# EAGLE design WearablesPlatineRFDuino-3 (EAGLE 7.6.0)
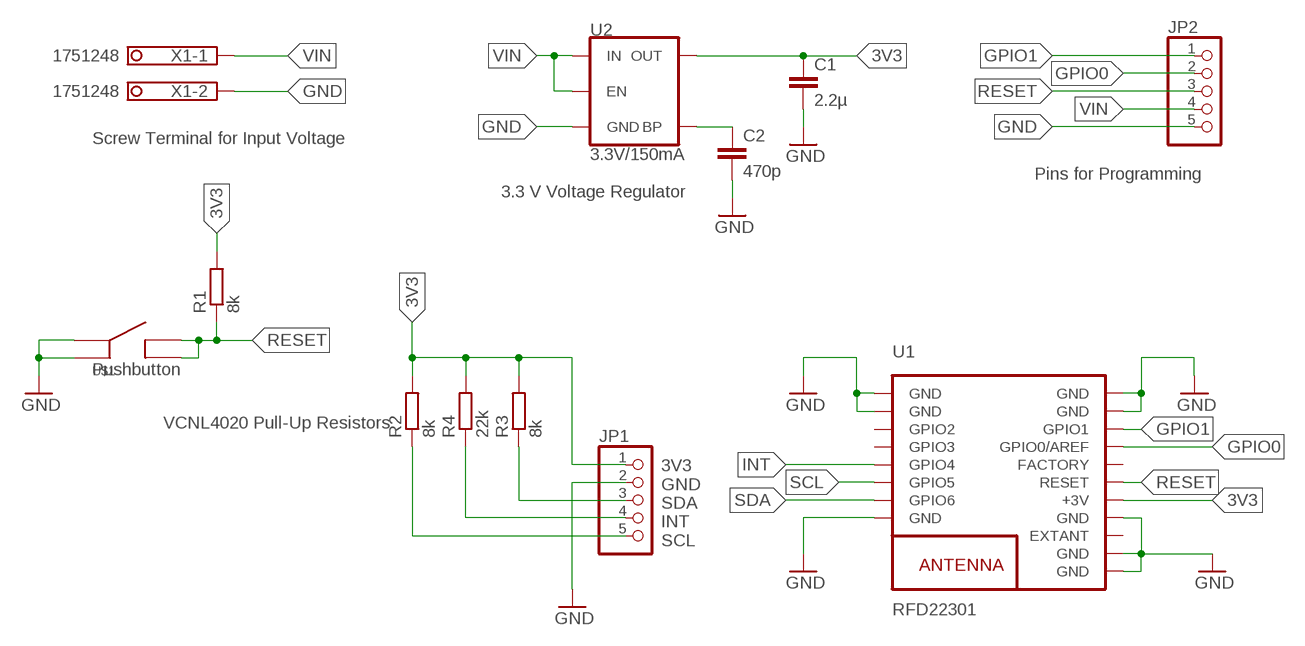
[diagram p0: schematic, sheet 1]

## Parts
C1  2.2µ  C-EUC0603  [C0603]
C2  470p  C-EUC0603  [C0603]
JP1  PINHD-1X5  [1X05]
JP2  PINHD-1X5  [1X05]
R1  8k  R-EU_R0603  [R0603]
R2  8k  R-EU_R0603  [R0603]
R3  8k  R-EU_R0603  [R0603]
R4  22k  R-EU_R0603  [R0603]
U1  RFD22301  [RFD22301]
U2  3.3V/150mA  V_REG_MIC52053.3V  [SOT23-5]
U$1  TACTILE_SWITCH  [EVQ-PUK02K]
X1  1751248  [1751248]

## Nets
3V3: C1.1 JP1.1 R1.2 R2.2 R3.2 R4.2 U1.13(+3V) U2.5(OUT)
GND: C1.2 C2.2 JP1.2 JP2.5 U1.1(GND) U1.2(GND) U1.8(GND) U1.9(GND) U1.10(GND) U1.12(GND) U1.18(GND) U1.19(GND) U2.2(GND) U$1.1(A) U$1.3(A) X1.2
GPIO0: JP2.2 U1.16(GPIO0/AREF)
GPIO1: JP2.1 U1.17(GPIO1)
INT: JP1.4 R4.1 U1.5(GPIO4)
N$5: C2.1 U2.4(BP)
RESET: JP2.3 R1.1 U1.14(RESET) U$1.2(B) U$1.4(B)
SCL: JP1.5 R2.1 U1.6(GPIO5)
SDA: JP1.3 R3.1 U1.7(GPIO6)
VIN: JP2.4 U2.1(IN) U2.3(EN) X1.1
Unconnected: U1.3(GPIO2) U1.4(GPIO3) U1.11(EXTANT) U1.15(FACTORY)

## Notes on the sheet
- Screw Terminal for Input Voltage
- Pins for Programming
- 3.3 V Voltage Regulator
- Pushbutton
- VCNL4020 Pull-Up Resistors
- 3V3
  GND
  SDA
  INT
  SCL

## Library data of the parts
C1 C2 = rcl:C-EU: CAPACITOR, European symbol
JP1 JP2 = pinhead:PINHD-1X5: PIN HEADER
R1-R4 = resistor:R-EU_: RESISTOR, European symbol
U1 = RF_Digital_RFD22301_Eagle_Schematic_PCB_Library:RFD22301: RFD22301 RFduino SMT Module RFD22301 Datasheet: http://www.rfdigital.com/wp-content/uploads/2014/03/RFD22301.Data_.Sheet_.11.24.13_11.38PM.pdf
U2 = SparkFun-IC-Power:V_REG_MIC5205: V_REG MIC5205 Standard 3.3V, 5V, and Adjustable 150mA LDO voltage regulator in SOT-23 layout. Micrel part MIC5205. BP (by-pass) pin is used to lower output noise with 470pF cap, may be left open. On the adjustable version BP is used to set output.; PROD_ID: VREG-00822
U$1 = jnode:TACTILE_SWITCH: collection of tactile switches; DIGIKEY: http://search.digikey.com/scripts/DkSearch/dksus.dll?Detail&name=P10852SCT-ND
X1 = con-phoenix-350:1751248: MKDS 1/ 2-3,5 Printklemme Nennstrom: 10 A Bemessungsspannung: 160 V Raster: 3,5 mm Polzahl: 2 Montageart: Löten Anschlussart: Schraubanschluss Anschlussrichtung vom Leiter zur Platine: 0° Source: http://eshop.phoenixcontact.com .. 1751248.pdf; OC_FARNELL: unknown; OC_NEWARK: unknown

## Board
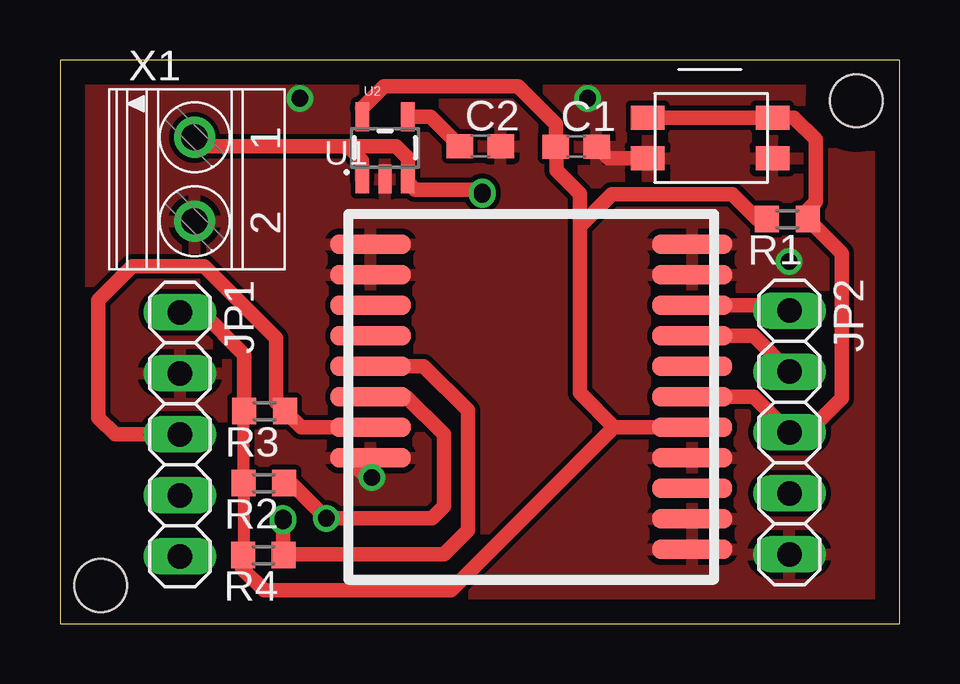
[diagram p1: board, top side]
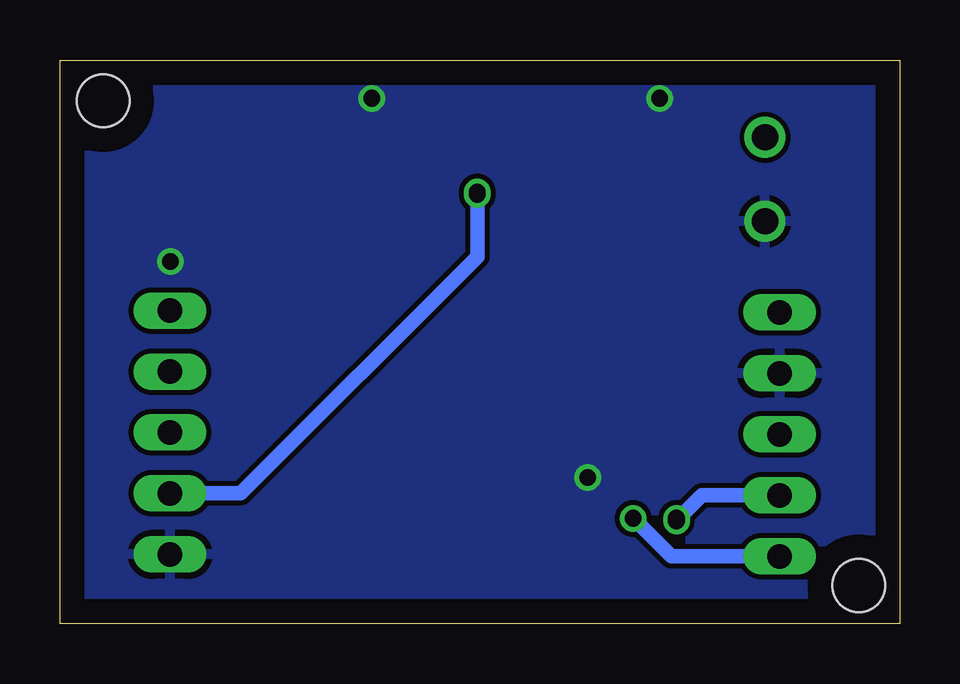
[diagram p2: board, bottom side, seen from below]

Size 35 x 23.5 mm. Coordinates in mm from the lower left corner, seen from the top.
Outline: 0,0 35,0 35,23.5 0,23.5 0,0
Copper layers (1*16): Top 0.035mm / dielectric 1.5mm / Bottom 0.035mm
Design rules "default *": minimum track width 10mil, minimum drill 24mil, track to track 8mil, track to pad 8mil, pad to pad 8mil, via to via 8mil, smd to smd 8mil, copper to edge 40mil, drill to drill 8mil, minimum pad ring 10mil, minimum via ring 8mil, stop-mask expansion 4mil, vias tented up to drill 0mil, thermal gap 10mil
Holes 2.2 mm at 1.7,1.6 33.2,21.8

### Footprints (pad centres in the part's own frame; a part is rotated, then mirrored left to right if it is on the bottom)
C0603 = smd 1.1 x 1: 1 -0.85,0; 2 0.85,0
1X05 = drill 1.016 long: 1 -5.08,0; 2 -2.54,0; 3 0,0; 4 2.54,0; 5 5.08,0
R0603 = smd 1 x 1.1: 1 -0.85,0; 2 0.85,0
RFD22301 = smd 3.353 x 0.813: 1 -6.706,7.62; 2 -6.706,6.35; 3 -6.706,5.08; 4 -6.706,3.81; 5 -6.706,2.54; 6 -6.706,1.27; 7 -6.706,0; 8 -6.706,-1.27; 9 6.706,-5.08; 10 6.706,-3.81; 11 6.706,-2.54; 12 6.706,-1.27; 13 6.706,0; 14 6.706,1.27; 15 6.706,2.54; 16 6.706,3.81; 17 6.706,5.08; 18 6.706,6.35; 19 6.706,7.62
SOT23-5 = smd 0.55 x 1.2: 1 -0.95,-1.3; 2 0,-1.3; 3 0.95,-1.3; 4 0.95,1.3; 5 -0.95,1.3
EVQ-PUK02K = smd 1.4 x 1: 1 5,2.5; 2 5,0.8; 3 -0.2,2.5; 4 -0.2,0.8
1751248 = drill 1.1 pad 1.7: 1 -1.75,-0.1; 2 1.75,-0.1

### Placement (x,y rotation side)
C1  21.52,19.89 0 top
C2  17.52,19.91 0 top
JP1  5,7.9 270 top
JP2  30.41,7.98 270 top
R1  30.32,16.87 180 top
R2  8.5,5.87 180 top
R3  8.53,8.87 180 top
R4  8.48,2.87 180 top
U1  19.65,8.2 0 top
U2  13.55,19.84 0 top
U$1  29.5,21.9 180 top
X1  5.71,18.53 270 top

### Tracks (layer width: path | path; a pad name or v marks a point on that pad's centre or on a via)
3V3
  Top 0.406: U2.5 12.6,21.5 | 7.65,2.89 R4.2 | 7.65,8.84 R3.2 | 29.07,16.87 R1.2
  Top 0.5: 7.65,2.89 R2.2 7.65,8.84
  Top 0.61: 21.67,16.57 21.67,9.63 23.1,8.2 | 23.1,8.2 U1.13 | 23.1,8.2 16.3,1.4 8.5,1.4 7.6,2.3 7.6,2.84 R4.2 | R3.2 7.68,11.22 5.92,12.98 JP1.1 | 21.67,16.57 23,17.9 28.04,17.9 29.07,16.87 | 12.6,21.5 13.5,22.4 19.1,22.4 20.67,20.83 C1.1 20.7,19.86 20.7,18.9 21.67,17.93 21.67,16.57
GND  (via drill 0.7 pad 1.02)
  Top 0.406: 12,6.9 12.03,6.93 U1.8
  Top 0.61: 12,6.9 12.8,6.1 v13,6.1 | C1.2 22.86,19.4 U$1.1
  other vias: 22,21.9 10,21.9 30.4,15.1
  pour Top: -2,23.9 38,23.9 38,-2.1 -2,-2.1
  pour Bottom: -1,24.9 37,24.9 37,-1.1 -1,-1.1
GPIO0
  Top 0.61: JP2.2 28.92,12.01 U1.16
GPIO1
  Top 0.61: JP2.1 30.19,13.28 U1.17
INT  (via drill 0.7 pad 1.02)
  Top 0.406: 9.36,2.9 R4.1 9.3,2.9
  Top 0.61: U1.5 15.16,10.74 17,8.9 17,3.9 16,2.9 9.36,2.9 | 9.3,2.9 v9.3,4.3
  Bottom 0.61: v9.3,4.3 8.24,5.36 JP1.4
N$2  (via drill 0.7 pad 1.02)
  other vias: 9.3,4.4
N$3  (via drill 0.7)
  other vias: 17.6,18
N$5
  Top 0.61: U2.4 15.44,21.14 C2.1
RESET
  Top 0.61: U$1.2 U$1.4 30.6,21.1 31.5,20.2 31.5,17.6 31.17,17.27 R1.1 32.6,15.44 32.6,9.4 31.18,7.98 JP2.3 28.92,9.47 U1.14
SCL  (via drill 0.7 pad 1.02)
  Top 0.406: U1.6 14.43,9.47 | 9.38,5.9 R2.1 9.63,5.87
  Top 0.61: 14.43,9.47 16,7.9 16,4.9 15.5,4.4 v11.1,4.4 9.63,5.87
  Bottom 0.61: v11.1,4.4 9.52,2.82 JP1.5
SDA
  Top 0.406: R3.1 9,9.25
  Top 0.61: U1.7 10.05,8.2 R3.1 | 9,9.25 9,11.9 6,14.9 3,14.9 1.6,13.5 1.6,8.6 2.3,7.9 JP1.3
VIN  (via drill 0.7)
  Top 0.406: X1.1 6,19.9
  Top 0.61: 6,19.9 12,19.9 | 12,19.9 12.6,19.3 U2.1 | 12,19.9 14,19.9 14.5,19.4 U2.3 14.5,18.4 14.8,18.1 17.4,18.1 v17.6,17.9
  Bottom 0.61: JP2.4 27.46,5.44 17.6,15.3 v17.6,17.9